# EAGLE design Relay (EAGLE 8.0.0)
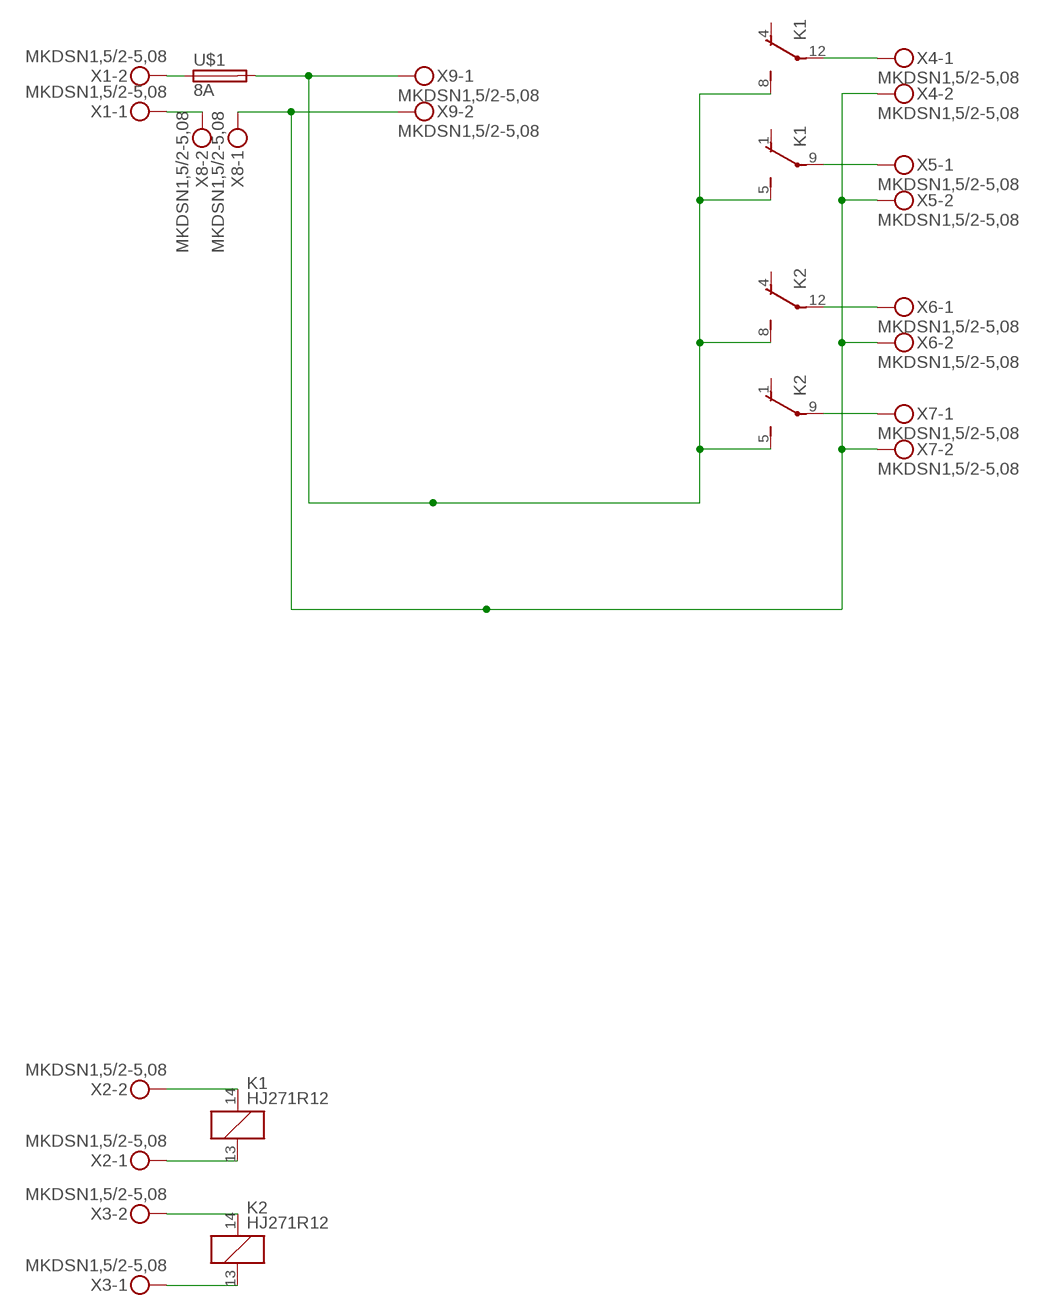
[diagram p0: schematic, sheet 1]

## Parts
K1  HJ271R12  [PT-2]
K2  HJ271R12  [PT-2]
U$1  8A  MF550(マルツ)  [MF550]
X1  MKDSN1,5/2-5,08  [MKDSN1,5/2-5,08]
X2  MKDSN1,5/2-5,08  [MKDSN1,5/2-5,08]
X3  MKDSN1,5/2-5,08  [MKDSN1,5/2-5,08]
X4  MKDSN1,5/2-5,08  [MKDSN1,5/2-5,08]
X5  MKDSN1,5/2-5,08  [MKDSN1,5/2-5,08]
X6  MKDSN1,5/2-5,08  [MKDSN1,5/2-5,08]
X7  MKDSN1,5/2-5,08  [MKDSN1,5/2-5,08]
X8  MKDSN1,5/2-5,08  [MKDSN1,5/2-5,08]
X9  MKDSN1,5/2-5,08  [MKDSN1,5/2-5,08]

## Nets
N$1: K1.12(2:P) X4.1
N$2: K1.9(3:P) X5.1
N$3: K2.12(2:P) X6.1
N$4: K2.9(3:P) X7.1
N$5: K1.14 X2.2
N$6: K1.13 X2.1
N$7: K2.14 X3.2
N$8: K2.13 X3.1
N$10: X1.1 X8.2
N$11: K1.5(3:S) K1.8(2:S) K2.5(3:S) K2.8(2:S) U$1.P$2 X9.1
N$12: U$1.P$1 X1.2
N$14: X4.2 X5.2 X6.2 X7.2 X8.1 X9.2
Unconnected: K1.1(3:O) K1.4(2:O) K2.1(3:O) K2.4(2:O)

## Library data of the parts
K1 K2 = 0リレー:HJ2*: モノタロウで売ってるやつ SCHRACK 2 pole 12 A DC- or AC-coil Source: http://www.schrack.com/.. 5823.pdf Socked 78602 Source: http://www.schrack.com/.. 5836.pdf; OC_FARNELL: unknown; OC_NEWARK: unknown
U$1 = (電源)ヒューズ:MF550(マルツ)
X1-X9 = con-phoenix-508:MKDSN1,5/2-5,08: MKDSN 1,5/ 2-5,08 Printklemme Nennstrom: 13,5 A Nennspannung: 250 V Rastermaß: 5,08 mm Polzahl: 2 Anschlussart: Schraubanschluss Montage: Löten Anschlussrichtung Leiter/Platine: 0 ° Artikelnummer: 1729128 Source: http://eshop.phoenixcontact.com .. 1729128.pdf

## Board
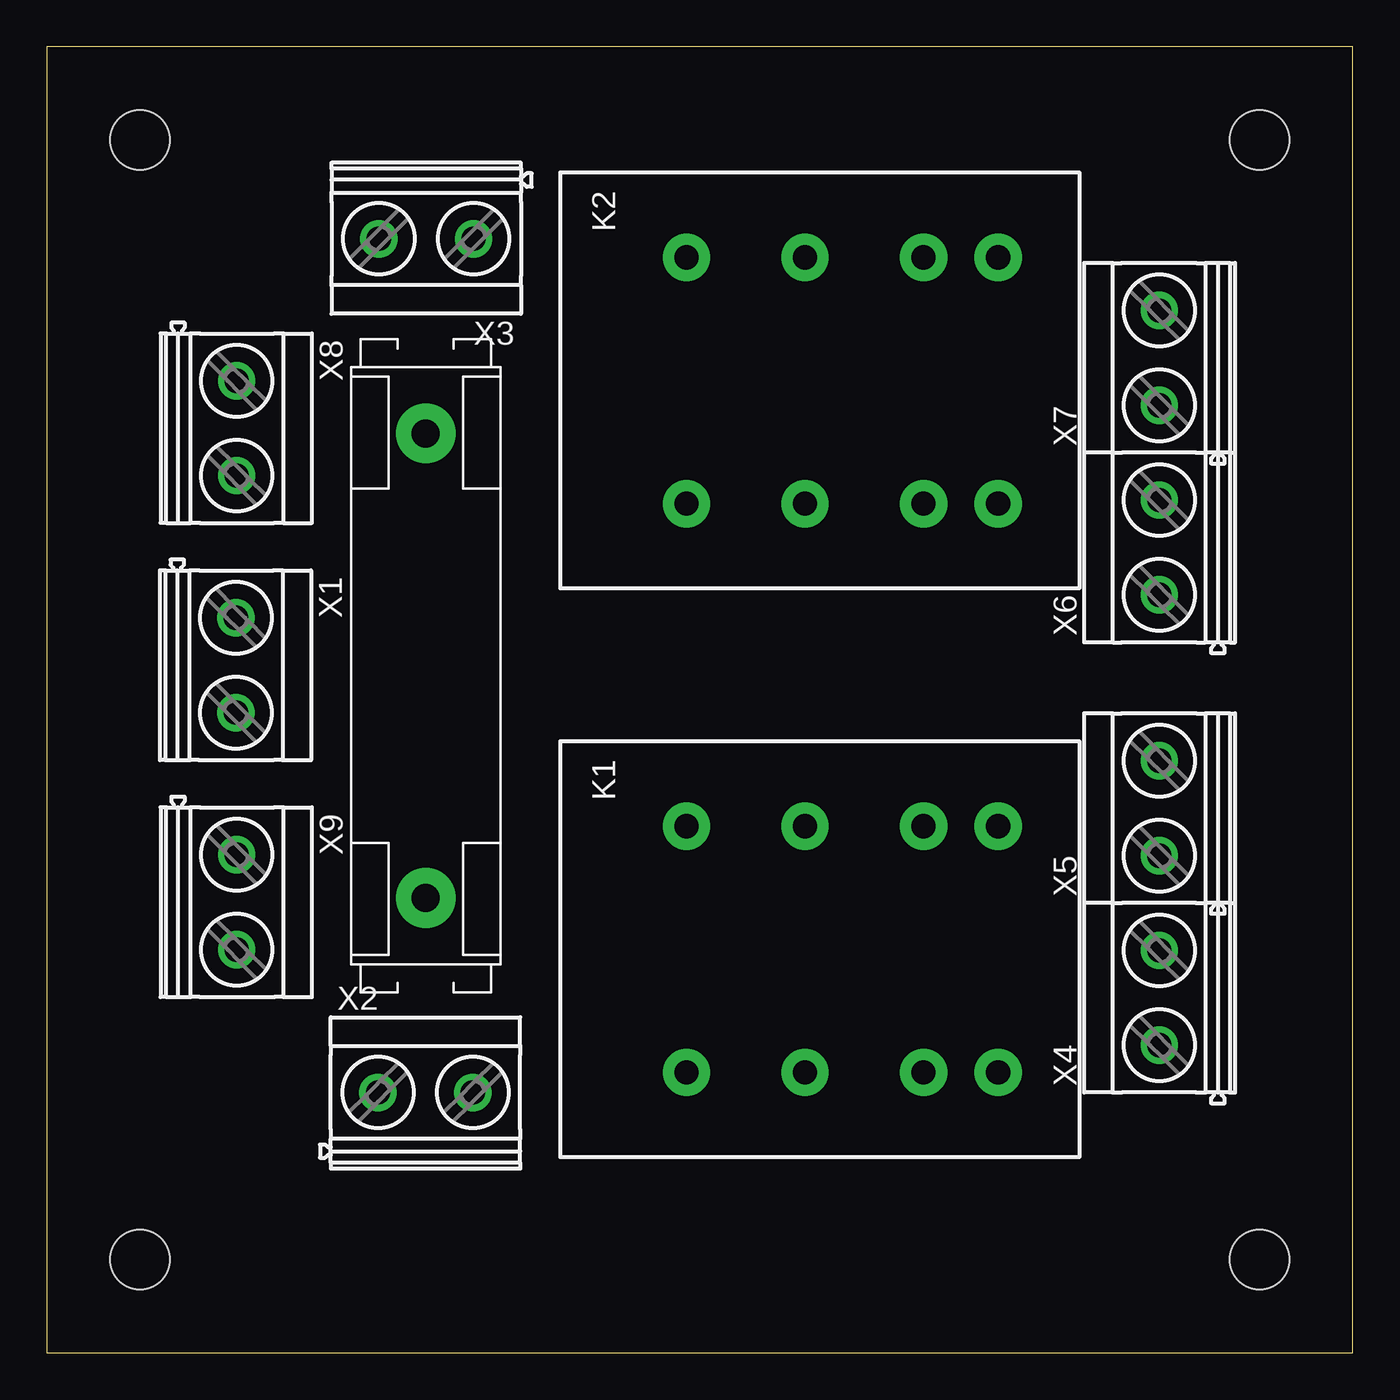
[diagram p1: board, top side]
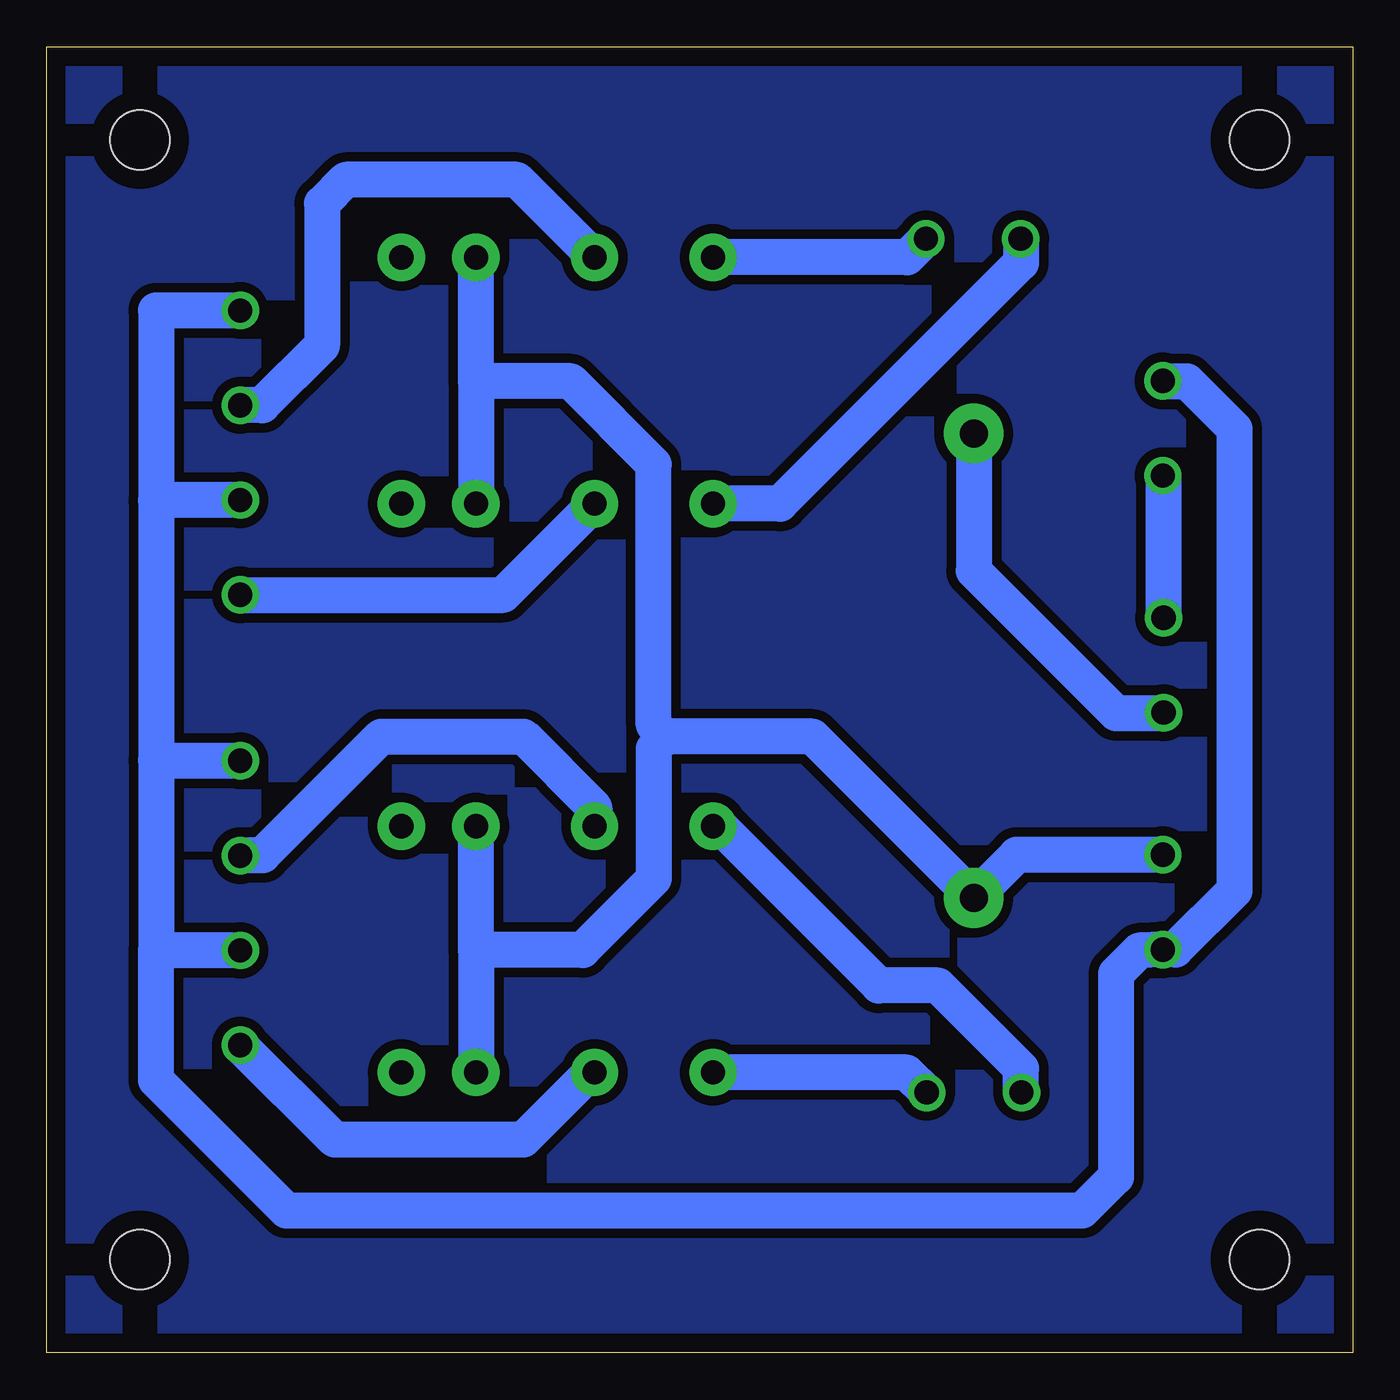
[diagram p2: board, bottom side, seen from below]

Size 70 x 70 mm. Coordinates in mm from the lower left corner, seen from the top.
Outline: 0,0 70,0 70,70 0,70 0,0
Copper layers (1*16): Top 0.035mm / dielectric 1.5mm / Bottom 0.035mm
Design rules "default *": minimum track width 10mil, minimum drill 24mil, track to track 20mil, track to pad 20mil, pad to pad 20mil, via to via 20mil, smd to smd 20mil, copper to edge 40mil, drill to drill 8mil, minimum pad ring 10mil, minimum via ring 8mil, stop-mask expansion 4mil, vias tented up to drill 0mil, thermal gap 10mil
Holes 3.2 mm at 5,5 65,5 65,65 5,65

### Footprints (pad centres in the part's own frame; a part is rotated, then mirrored left to right if it is on the bottom)
PT-2 = drill 1.3 pad 2.54: 1 -6.6,16.7; 4 6.6,16.7; 5 -6.6,12.7; 8 6.6,12.7; 9 -6.6,6.35; 12 6.6,6.35; 13 -6.6,0; 14 6.6,0
MF550 = drill 1.5 pad 3.2: P$1 -12.446,0; P$2 12.446,0
MKDSN1,5/2-5,08 = drill 1.3 pad 2: 1 -2.561,0.025; 2 2.519,0.025

### Placement (x,y rotation side)
K1  34.29,21.63 270 top
K2  34.29,52.11 270 top
U$1  20.32,36.83 270 top
X1  10.12,36.83 270 top
X2  20.32,13.93 0 top
X3  20.32,59.73 180 top
X4  59.65,19.05 90 top
X5  59.65,29.21 90 top
X6  59.65,43.18 90 top
X7  59.65,53.34 90 top
X8  10.16,49.53 270 top
X9  10.16,24.13 270 top

### Tracks (layer width: path | path; a pad name or v marks a point on that pad's centre or on a via)
N$1
  Bottom 1.93: X4.1 54.57,11.43 44.45,11.43 40.85,15.03 K1.12
N$2
  Bottom 1.93: X5.1 59.6,26.67 58.42,26.67 52.07,33.02 44.45,33.02 40.64,29.21 K1.9
N$3
  Bottom 1.93: X6.1 45.53,40.62 K2.12
N$4
  Bottom 1.93: K2.9 44.8,62.87 53.98,62.87 55.24,61.59 55.24,53.98 58.44,50.78 X7.1
N$5
  Bottom 1.93: X2.2 23.91,15.03 K1.14
N$6
  Bottom 1.93: X2.1 17.78,13.98 17.78,15.24 22.23,19.68 25.4,19.68 33.95,28.23 K1.13
N$7
  Bottom 1.93: X3.2 17.78,59.68 17.78,58.42 30.69,45.51 K2.14
N$8
  Bottom 1.93: X3.1 23.88,58.71 K2.13
N$9
  pour Bottom: 0,70 70,70 70,0 0,0
N$10
  Bottom 1.93: X8.2 10.14,47.01 X1.1
N$11
  Bottom 1.93: X9.1 18.01,26.69 U$1.P$2 28.96,33.02 36.83,33.02 | 46.99,21.59 K1.8 | 46.99,21.59 K1.5 | 46.99,52.07 K2.8 | 46.99,52.07 K2.5 | 36.83,33.02 37.47,32.38 37.47,25.4 41.27,21.59 46.99,21.59 | 36.83,33.02 37.47,33.66 37.47,47.62 41.91,52.07 46.99,52.07
N$12
  Bottom 1.93: U$1.P$1 20.32,41.91 12.7,34.29 10.17,34.29 X1.2
N$14
  Bottom 1.93: 64.14,21.59 64.14,14.61 57.15,7.62 14.51,7.62 12.7,9.43 12.7,20.32 11.46,21.57 X9.2 9.5,21.61 6.35,24.77 6.35,49.53 8.89,52.07 10.16,52.07 X8.1 | 64.14,21.59 59.65,21.59 X4.2 | 64.14,31.75 64.14,21.59 | X5.2 64.11,31.73 64.14,31.75 | X6.2 64.14,45.7 | 64.14,45.7 64.14,31.75 | X7.2 64.14,55.86 64.14,45.7